# Altium schematic sheet BoardInterfaces_SarSol.SchDoc
size Tabloid; SheetNumber: 2; SheetTotal: 6
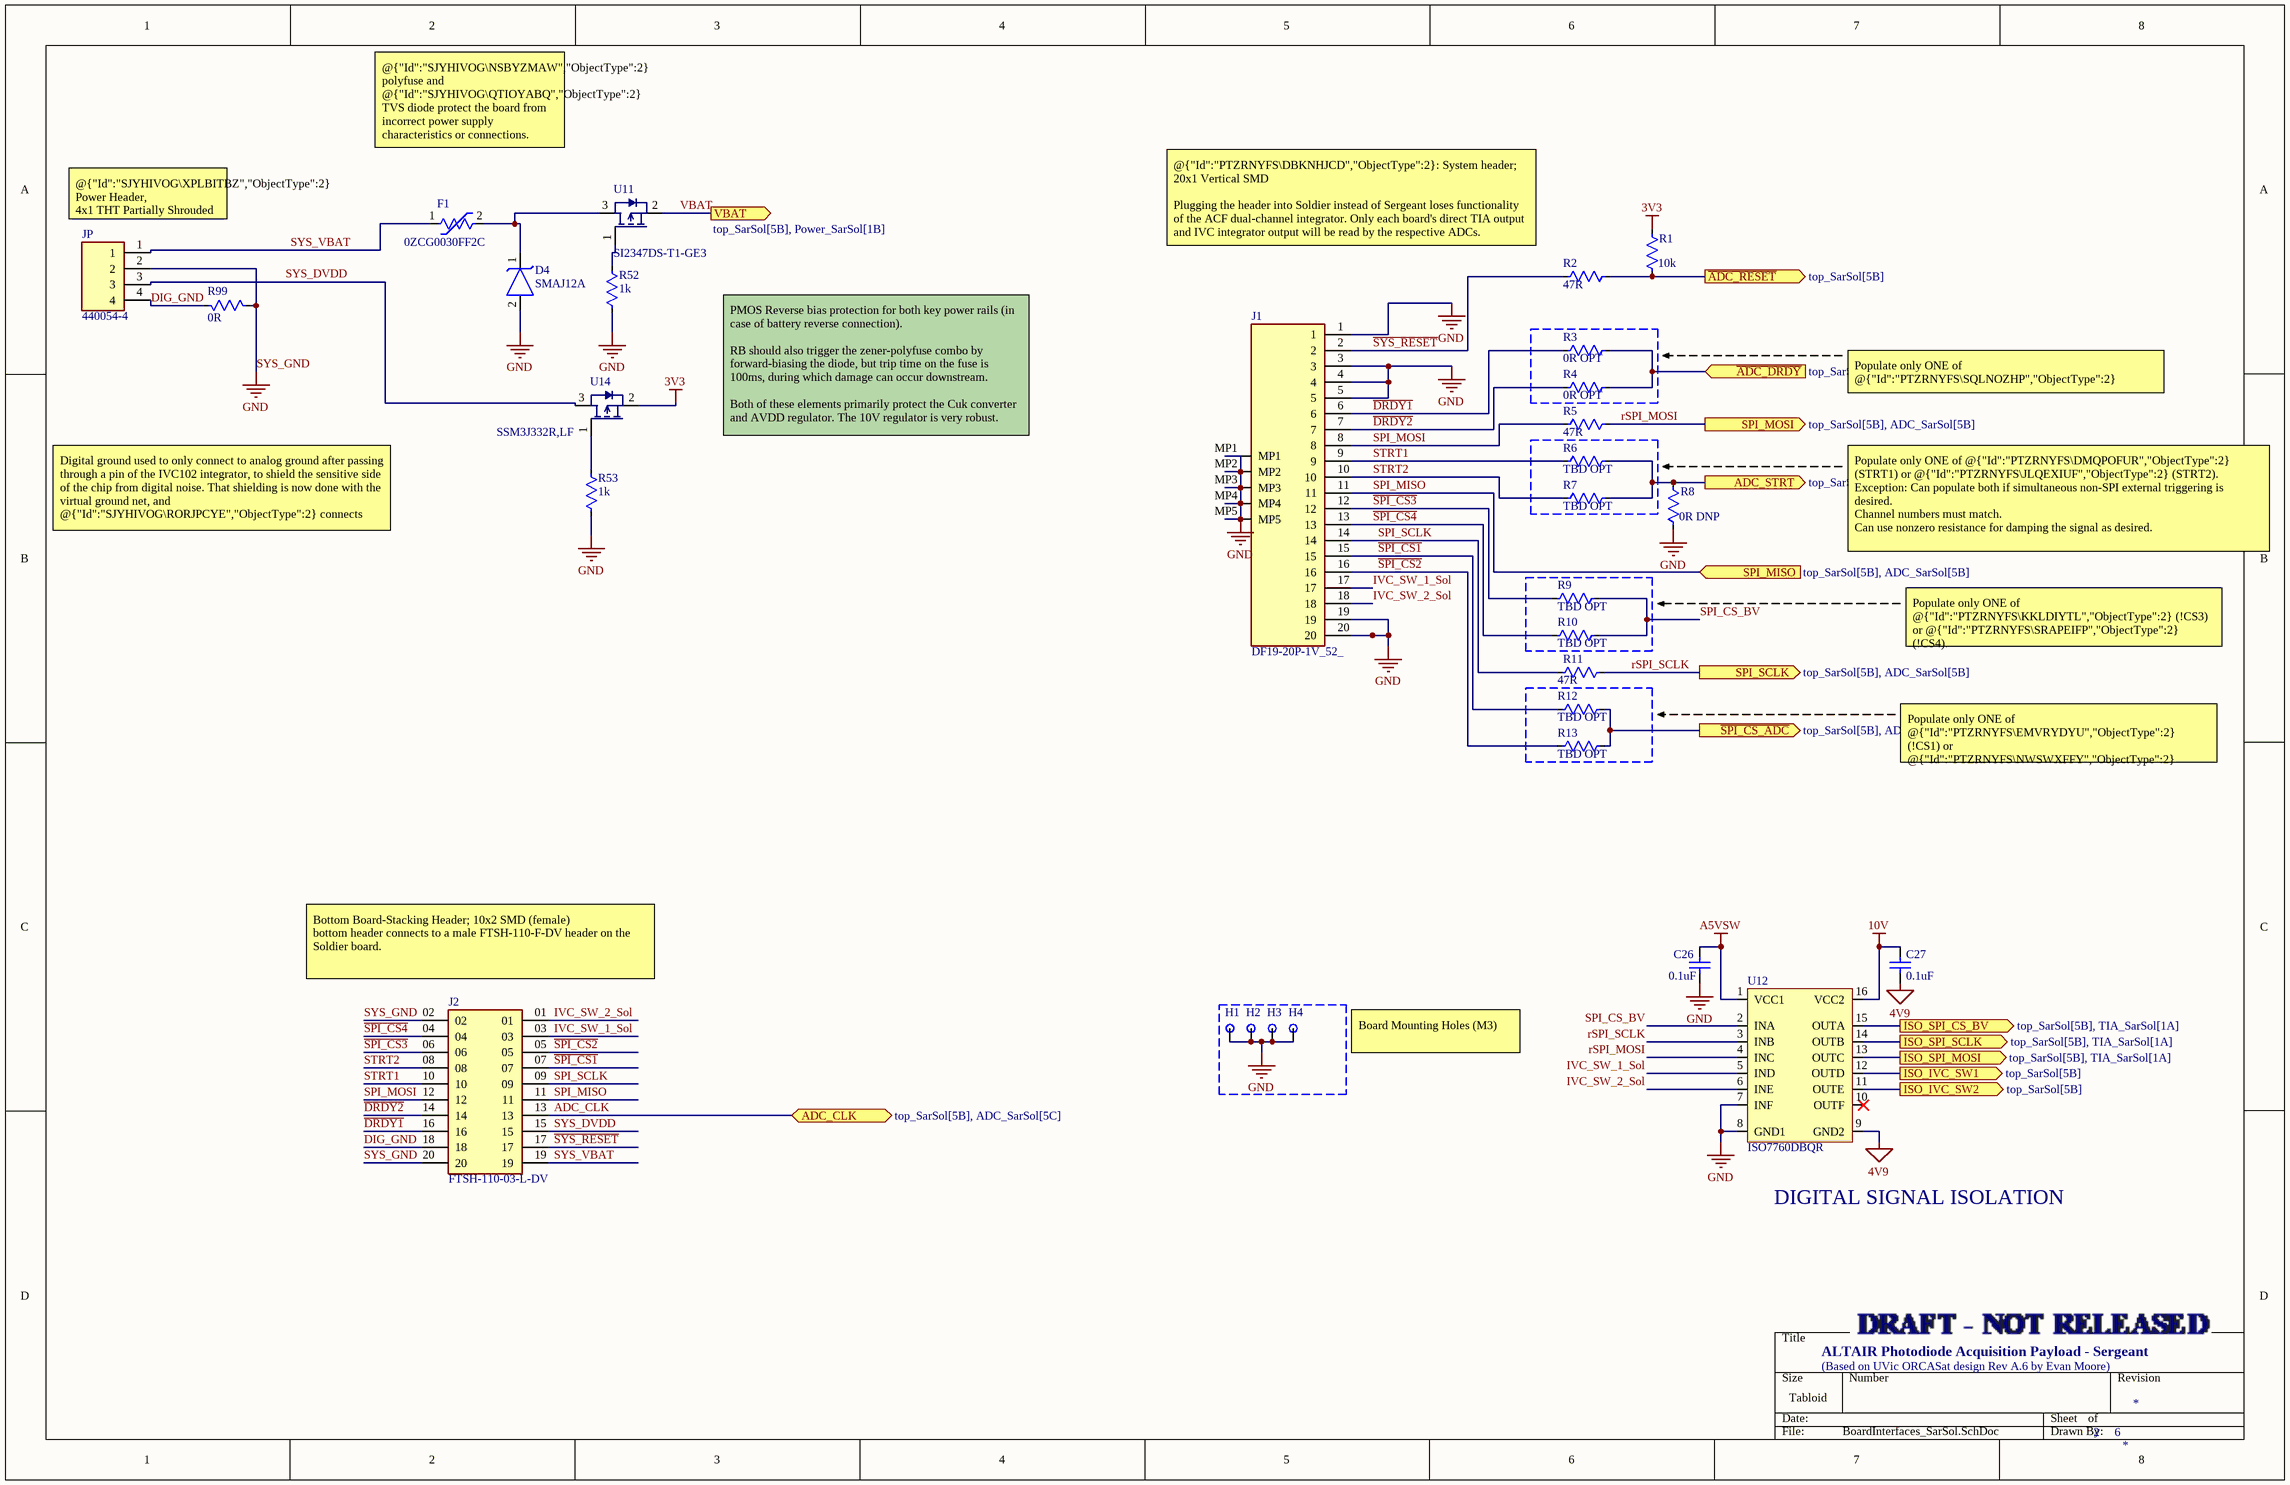
[diagram p0: BoardInterfaces_SarSol.SchDoc]

## Parts
C26  0.1uF  [CAP 0603 IPC MID DENSITY]
C27  0.1uF  [CAP 0603 IPC MID DENSITY]
D4  SMAJ12A  [DO-214AC SMA VISHAY]
F1  0ZCG0030FF2C  [POLYFUSE 1812 NON-IPC BELFUSE]
H1  Mount-hole  [M3 PTH FOR 4.5MM HEX]  (value not drawn)  (no BOM)
H2  Mount-hole  [M3 PTH FOR 4.5MM HEX]  (value not drawn)  (no BOM)
H3  Mount-hole  [M3 PTH FOR 4.5MM HEX]  (value not drawn)  (no BOM)
H4  Mount-hole  [M3 PTH FOR 4.5MM HEX]  (value not drawn)  (no BOM)
J1  DF19-20P-1V_52_  [HEADER MALE 20x1 1MM PITCH SMD]
J2  FTSH-110-03-L-DV  [HEADER MALE 10X2 1.27MM PITCH FTSH]
JP  440054-4  [HEADER MALE 4x1 2MM PITCH THT]
R1  10k  [RES 0603 IPC MID DENSITY]
R2  47R  [RES 0402 NON-IPC SEI]
R3  0R OPT  [RES 0402 IPC MID DENSITY]
R4  0R OPT  [RES 0402 IPC MID DENSITY]
R5  47R  [RES 0402 NON-IPC SEI]
R6  TBD OPT  [RES 0402 IPC MID DENSITY]
R7  TBD OPT  [RES 0402 IPC MID DENSITY]
R8  0R DNP  [RES 0603 IPC MID DENSITY]
R9  TBD OPT  [RES 0402 IPC MID DENSITY]
R10  TBD OPT  [RES 0402 IPC MID DENSITY]
R11  47R  [RES 0402 NON-IPC SEI]
R12  TBD OPT  [RES 0402 IPC MID DENSITY]
R13  TBD OPT  [RES 0402 IPC MID DENSITY]
R52  1k  [RES 0603 IPC MID DENSITY]
R53  1k  [RES 0603 IPC MID DENSITY]
R99  0R  [RES 0402 IPC MID DENSITY]
U11  SI2347DS-T1-GE3  [SOT95P245X110-3N]
U12  ISO7760DBQR  [16-SSOP 0.635MM PITCH 5.4MM WIDTH NON-IPC TI]
U14  SSM3J332R,LF  [SOT95P245X110-3N]

## Ports
ADC_CLK (bidir, see top_SarSol[5B], ADC_SarSol[5C]), ADC_STRT (out, see top_SarSol[5B]), ISO_IVC_SW1 (out, see top_SarSol[5B]), ISO_IVC_SW2 (out, see top_SarSol[5B]), ISO_SPI_CS_BV (out, see top_SarSol[5B], TIA_SarSol[1A]), ISO_SPI_MOSI (out, see top_SarSol[5B], TIA_SarSol[1A]), ISO_SPI_SCLK (out, see top_SarSol[5B], TIA_SarSol[1A]), SPI_MISO (in, see top_SarSol[5B], ADC_SarSol[5B]), SPI_MOSI (out, see top_SarSol[5B], ADC_SarSol[5B]), SPI_SCLK (out, see top_SarSol[5B], ADC_SarSol[5B]), VBAT (out, see top_SarSol[5B], Power_SarSol[1B]), ~{ADC_DRDY} (in, see top_SarSol[5B]), ~{ADC_RESET} (out, see top_SarSol[5B]), ~{SPI_CS_ADC} (out, see top_SarSol[5B], ADC_SarSol[5B])

## Nets
3V3: R1.1 U14.2(Source)
4V9: C27.1 U12.9(GND2)
10V: C27.2 U12.16(VCC2)
A5VSW: C26.2 U12.1(VCC1)
SYS_GND: C26.1 D4.2(Anode) H1.1 H2.1 H3.1 H4.1 J1.1 J1.3 J1.4 J1.5 J1.19 J1.20 J1.MP1 J1.MP2 J1.MP3 J1.MP4 J1.MP5 J2.02 J2.20 JP.2 R8.2 R52.1 R53.1 R99.1 U12.7(INF) U12.8(GND1)  [also labelled GND]
~{ADC_DRDY}: R3.2 R4.2 ; port ~{ADC_DRDY}
~{ADC_RESET}: R1.2 R2.2 ; port ~{ADC_RESET}
~{DRDY1}: J1.6 J2.16 R3.1
~{DRDY2}: J1.7 J2.14 R4.1
~{SPI_CS1}: J1.15 J2.07 R12.1
~{SPI_CS2}: J1.16 J2.05 R13.1
~{SPI_CS3}: J1.12 J2.06 R9.1
~{SPI_CS4}: J1.13 J2.04 R10.1
~{SPI_CS_ADC}: R12.2 R13.2 ; port ~{SPI_CS_ADC}
~{SYS_RESET}: J1.2 J2.17 R2.1
ADC_CLK: J2.13 ; port ADC_CLK
ADC_STRT: R6.2 R7.2 R8.1 ; port ADC_STRT
DIG_GND: J2.18 JP.4 R99.2
ISO_IVC_SW1: U12.12(OUTD) ; port ISO_IVC_SW1
ISO_IVC_SW2: U12.11(OUTE) ; port ISO_IVC_SW2
ISO_SPI_CS_BV: U12.15(OUTA) ; port ISO_SPI_CS_BV
ISO_SPI_MOSI: U12.13(OUTC) ; port ISO_SPI_MOSI
ISO_SPI_SCLK: U12.14(OUTB) ; port ISO_SPI_SCLK
IVC_SW_1_Sol: J1.17 J2.03 U12.5(IND)
IVC_SW_2_Sol: J1.18 J2.01 U12.6(INE)
rSPI_MOSI: R5.2 U12.4(INC) ; port SPI_MOSI
rSPI_SCLK: R11.2 U12.3(INB) ; port SPI_SCLK
SPI_CS_BV: R9.2 R10.2 U12.2(INA)
SPI_MISO: J1.11 J2.11 ; port SPI_MISO
SPI_MOSI: J1.8 J2.12 R5.1
SPI_SCLK: J1.14 J2.09 R11.1
STRT1: J1.9 J2.10 R6.1
STRT2: J1.10 J2.08 R7.1
SYS_DVDD: J2.15 JP.3 U14.3(Drain)
SYS_VBAT: F1.1 J2.19 JP.1
VBAT: U11.2(Source) ; port VBAT
NetD4_1: D4.1(Cathode) F1.2 U11.3(Drain)
NetR52_2: R52.2 U11.1(Gate)
NetR53_2: R53.2 U14.1(Gate)

Not connected (* = marked no-connect by the designer): U12 10(OUTF)*

## Notes on the sheet
- @{"Id":"SJYHIVOG\NSBYZMAW","ObjectType":2} polyfuse and @{"Id":"SJYHIVOG\QTIOYABQ","ObjectType":2} TVS diode protect the board from incorrect power supply characteristics or connections.
  Rated for up to 14V and 300mA.
- (near JP) @{"Id":"SJYHIVOG\XPLBITBZ","ObjectType":2} Power Header,
  4x1 THT Partially Shrouded
- (near R2) @{"Id":"PTZRNYFS\DBKNHJCD","ObjectType":2}: System header; 20x1 Vertical SMD
  Plugging the header into Soldier instead of Sergeant loses functionality of the ACF dual-channel integrator. Only each board's direct TIA output and IVC integrator output will be read by the respective ADCs.
- PMOS Reverse bias protection for both key power rails (in case of battery reverse connection).
  RB should also trigger the zener-polyfuse combo by forward-biasing the diode, but trip time on the fuse is 100ms, during which damage can occur downstream.
  Both of these elements primarily protect the Cuk converter and AVDD regulator. The 10V regulator is very robust.
- Populate only ONE of @{"Id":"PTZRNYFS\SQLNOZHP","ObjectType":2} (!DRDY1) or @{"Id":"PTZRNYFS\BBASJRRG","ObjectType":2} (!DRDY2).
  Channel numbers must match.
- Digital ground used to only connect to analog ground after passing through a pin of the IVC102 integrator, to shield the sensitive side of the chip from digital noise. That shielding is now done with the virtual ground net, and @{"Id":"SJYHIVOG\RORJPCYE","ObjectType":2} connects digital ground to analog ground close to the power header.
- Populate only ONE of @{"Id":"PTZRNYFS\DMQPOFUR","ObjectType":2} (STRT1) or @{"Id":"PTZRNYFS\JLQEXIUF","ObjectType":2} (STRT2).
  Exception: Can populate both if simultaneous non-SPI external triggering is desired.
  Channel numbers must match.
  Can use nonzero resistance for damping the signal as desired.
  Populate @{"Id":"PTZRNYFS\PRXHVUPJ","ObjectType":2} if configuring ADC conversion through SPI commands instead.
- Populate only ONE of @{"Id":"PTZRNYFS\KKLDIYTL","ObjectType":2} (!CS3) or @{"Id":"PTZRNYFS\SRAPEIFP","ObjectType":2} (!CS4).
  Channel numbers must match.
  Can use nonzero resistance for damping the signal as desired.
- Populate only ONE of @{"Id":"PTZRNYFS\EMVRYDYU","ObjectType":2} (!CS1) or @{"Id":"PTZRNYFS\NWSWXFFY","ObjectType":2} (!CS2).
  Channel numbers must match.
  Can use nonzero resistance for damping the signal as desired.
- (near J2) Bottom Board-Stacking Header; 10x2 SMD (female)
  bottom header connects to a male FTSH-110-F-DV header on the Soldier board.
- Board Mounting Holes (M3)
- DIGITAL SIGNAL ISOLATION
- ALTAIR Photodiode Acquisition Payload - Sergeant
- (Based on UVic ORCASat design Rev A.6 by Evan Moore)

## Library data of the parts
C26 C27 = CAP: Kemet C0603C104K5RACAUTO - Cap Ceramic 0.1uF 50V X7R 10% 0603 125C Paper T/R; MF: Kemet; MP: C0603C104K5RACAUTO
D4 = Zener: Vishay SMAJ12A-M3/61 - TVS Diode 12V Standoff 13.3V Breakdown DO-214AC; MF: Vishay General Semiconductor; MP: SMAJ12A-M3/61
F1 = Polyfuse: Bel Fuse 0ZCG0030FF2C - Polymeric PTC Resettable Fuse 30V 300mA hold 600mA trip SMD 1812; MF: Bel Fuse Inc.; MP: 0ZCG0030FF2C
H1-H4 = Mount-hole: (Plated) Mounting hole
J1 = DF19-20P-1V_52_: 20x1 Header SMD; MF: Hirose; MP: DF19-20P-1V(52); Datasheet Link: https://www.hirose.com/en/product/document?clcode=CL0685-0037-0-52&productname=DF19-20P-1V(52)&series=DF19&documenttype=2DDrawing&lang=en&documentid=0001394451; Height: 5.37mm; Mouser Part Number: 798-DF1920P1V52; Mouser Price/Stock: https://www.mouser.co.uk/ProductDetail/Hirose-Connector/DF19-20P-1V52?qs=QNEnbhJQKvayaXitD7MtBA%3D%3D
J2 = CLP-110-02-X-D: 10x2 Position Pin Connector 0.050 (1.27mm) Surface Mount, Gold; Alt parts FTSH-110-03-F-DV (thinner gold), FTSH-110-03-F-DV-P (thinner gold + pick and place); MF: Samtec; MP: FTSH-110-03-L-DV
JP = 440054-4: 4x1 Header SMD Partial Shroud; MF: TE Connectivity; Datasheet Link: https://www.te.com/commerce/DocumentDelivery/DDEController?Action=srchrtrv&DocNm=1-1773713-2_HPI_QRG_EN&DocType=Data%20Sheet&DocLang=English&PartCntxt=440054-4&DocFormat=pdf; Height: 6.35mm; MP: 440054-4; Mouser Part Number: 571-440054-4; Mouser Price/Stock: https://www.mouser.co.uk/ProductDetail/TE-Connectivity/440054-4?qs=JFPmFzpscO7310iGSDds%2FA%3D%3D; Arrow Part Number: 440054-4; Arrow Price/Stock: https://www.arrow.com/en/products/440054-4/te-connectivity?utm_currency=USD&region=europe
R1 = RES: Vishay CRCW060310K0FKEA SMD 0603 10k, CRCW e3 Series, 75V, thick film, 100mW; MF: Vishay Dale; MP: CRCW060310K0FKEA
R2 R5 R11 = RES: Stackpole RMCF0402JT47R0 - Res 47Ohm 5% 0.063W 0402 Thick Film AEC-Q200 compliant; MF: Stackpole Electronics Inc.; MP: RMCF0402JT47R0
R3 R4 R8 R99 = RES: Yageo RC0402JR-070RL - Res 0 Ohms 1/16W SMD 0402; MF: YAGEO; MP: RC0402JR-070RL
R6 R7 R9 R10 R12 R13 = RES: Stackpole RMCF0402JT47R0 - Res 47Ohm 5% 0.063W 0402 Thick Film AEC-Q200 compliant (Placeholder); MF: Stackpole Electronics Inc.; MP: RMCF0402JT47R0
R52 R53 = RES: Res, Any, Manually select footprint
U11 = PMOS: MOSFET P-CH 30V 5A SOT23-3; Supplier 1: Avnet; Supplier Part Number 1: SI2347DS-T1-GE3
U12 = ISO7760DBQR: Digital Isolator 6-Channel 6/0 Inputs 16SSOP; MF: Texas Instruments; MP: ISO7760DBQR
U14 = PMOS_LV: P-Channel 30 V 6A (Ta) 1W (Ta) Surface Mount SOT-23F; Supplier 1: Avnet; Supplier Part Number 1: SI2347DS-T1-GE3